# Altium schematic sheet 海关全向控制器主控板电路V4_HC-05.SchDoc
size A4
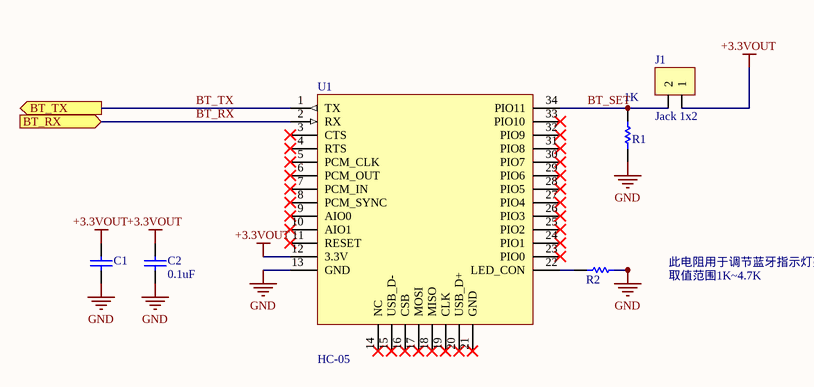
[diagram p0: 海关全向控制器主控板电路V4_HC-05.SchDoc]

## Parts
C1  10uF  [C0805]  (value not drawn)
C2  0.1uF  [C0805]
J1  Jack 1x2  [A6S-1101-PH]
R1  1K  [R0805]
R2  1K  [R0805]  (value not drawn)
U1  HC-05  [HC-05]

## Ports
BT_RX (in), BT_TX (out)

## Nets
+3.3VOUT: C1.1 C2.2 J1.1 U1.12(3.3V)
GND: C1.2 C2.1 R1.2 R2.1 U1.13(GND)
BT_RX: U1.2(RX) ; port BT_RX
BT_SET: J1.2 R1.1 U1.34(PIO11)
BT_TX: U1.1(TX) ; port BT_TX
NetR2_2: R2.2 U1.22(LED_CON)

Not connected (* = marked no-connect by the designer): U1 3(CTS)* 4(RTS)* 5(PCM_CLK)* 6(PCM_OUT)* 7(PCM_IN)* 8(PCM_SYNC)* 9(AIO0)* 10(AIO1)* 11(RESET)* 14(NC)* 15(USB_D-)* 16(CSB)* 17(MOSI)* 18(MISO)* 19(CLK)* 20(USB_D+)* 21(GND)* 23(PIO0)* 24(PIO1)* 25(PIO2)* 26(PIO3)* 27(PIO4)* 28(PIO5)* 29(PIO6)* 30(PIO7)* 31(PIO8)* 32(PIO9)* 33(PIO10)*

## Notes on the sheet
- 此电阻用于调节蓝牙指示灯亮度
- 取值范围1K~4.7K

## Library data of the parts
C1 = CAP: Published: 8-Jun-2000; LatestRevisionDate: 17-Jul-2002; LatestRevisionNote: Re-released for DXP Platform.; PackageReference: RAD-0.3; Publisher: Altium Limited
C2 = Cap Semi
J1 = Jack 1x2: 插座
R1 R2 = Res